# EAGLE schematic Switching Circuit (EAGLE 7.7.0)
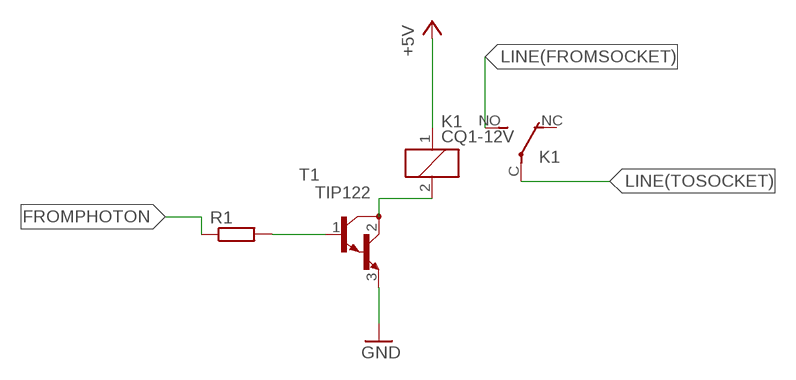
[diagram p0: schematic, sheet 1]

## Parts
K1  CQ1-12V  [CQ1]
R1  R-EU_0204/7  [0204/7]
T1  TIP122  [TO220]

## Nets
+5V: K1.1
FROMPHOTON: R1.1
GND: T1.3(E)
LINE(FROMSOCKET): K1.NO(2:S)
LINE(TOSOCKET): K1.C(2:P)
N$1: R1.2 T1.1(B)
N$4: K1.2 T1.2(C)
Unconnected: K1.NC(2:O)

## Library data of the parts
K1 = relay:CQ1-12V: AUTOMOTIVE QUIET RELAY NAiS Source: http://www.mew-europe.com/.. en_ds_61208_0000.pdf; OC_FARNELL: unknown; OC_NEWARK: unknown
R1 = resistor:R-EU_: RESISTOR, European symbol
T1 = transistor:TIP122: NPN BIPOLAR DARLINGTON TRANSISTOR